# EAGLE design Adafruit Proto Doubler PiCowbell (EAGLE 9.6.2)
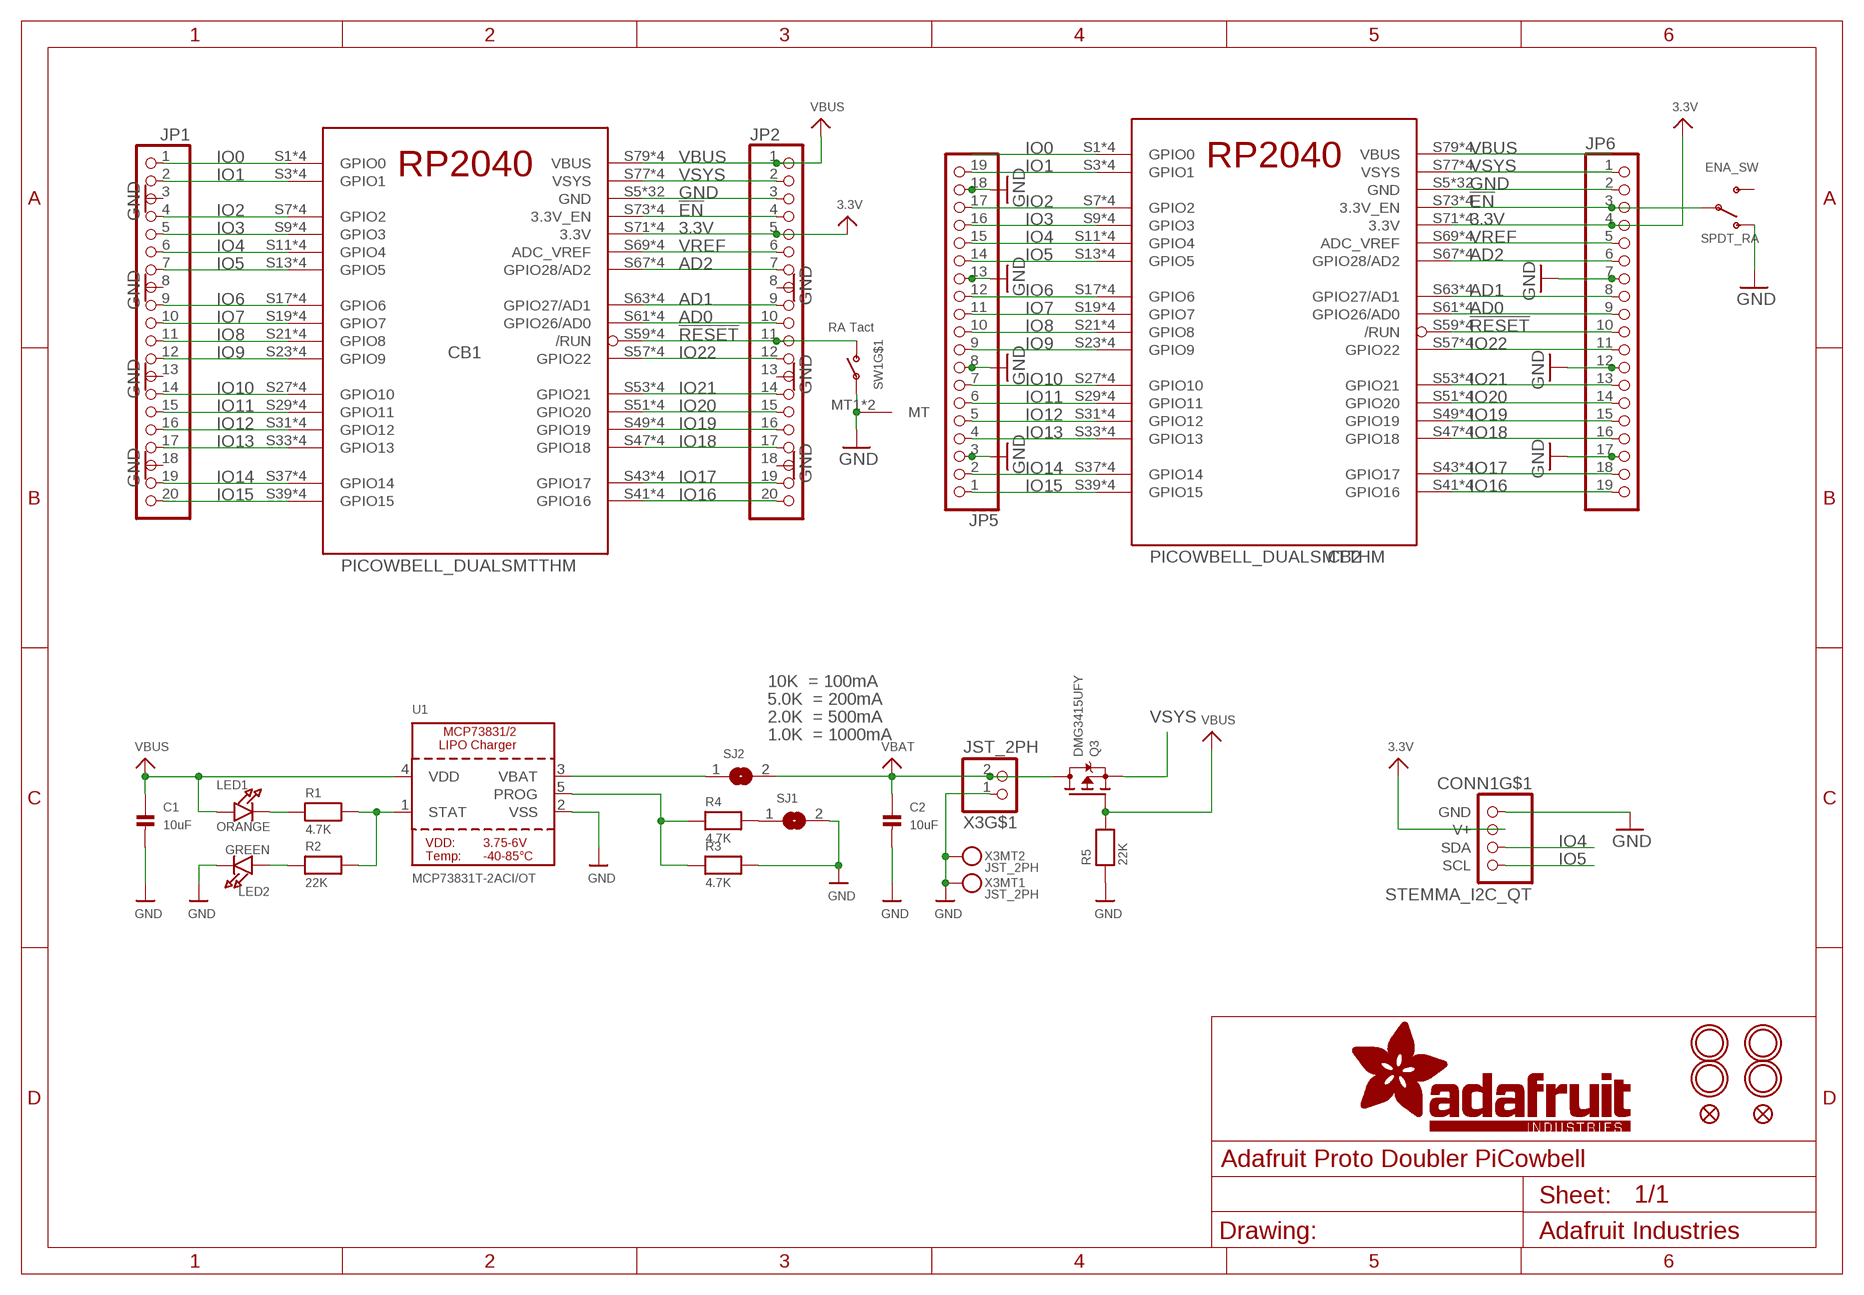
[diagram p0: schematic, sheet 1]

## Parts
C1  10uF  CAP_CERAMIC0805-NOOUTLINE  [0805-NO]
C2  10uF  CAP_CERAMIC0805-NOOUTLINE  [0805-NO]
CB1  PICOWBELL_DUALSMTTHM  [PICOWBELL_DUALSMTTHM]
CB2  PICOWBELL_DUALSMTTHM  [PICOWBELL_DUALSMTTHM]
CONN1  STEMMA_I2C_QT  [JST_SH4]
ENA_SW  SPDT_RA  SWITCH_SPDT  [SPDT_SMT_SSSS811101]
FID1  FIDUCIAL_1MM  [FIDUCIAL_1MM]
FID2  FIDUCIAL_1MM  [FIDUCIAL_1MM]
JP1  HEADER-1X20_70MIL  [1X20_ROUND_70MIL]
JP2  HEADER-1X20_70MIL  [1X20_ROUND_70MIL]
JP5  HEADER-1X19  [1X19_ROUND]
JP6  HEADER-1X19  [1X19_ROUND]
LED1  ORANGE  LED0603_NOOUTLINE  [CHIPLED_0603_NOOUTLINE]
LED2  GREEN  LED0603_NOOUTLINE  [CHIPLED_0603_NOOUTLINE]
Q3  DMG3415UFY  MOSFET-P_DFN2015  [DFN2015-3]
R1  4.7K  RESISTOR_0402NO  [_0402NO]
R2  22K  RESISTOR_0402NO  [_0402NO]
R3  4.7K  RESISTOR_0402NO  [_0402NO]
R4  4.7K  RESISTOR_0402NO  [_0402NO]
R5  22K  RESISTOR_0402NO  [_0402NO]
SJ1  SOLDERJUMPERCLOSED  [SOLDERJUMPER_CLOSEDWIRE]
SJ2  SOLDERJUMPERCLOSED  [SOLDERJUMPER_CLOSEDWIRE]
SW1  RA Tact  SWITCH_SPST_MNT_TACT_RA  [SPST_TACTILE_RA]
U1  MCP73831T-2ACI/OT  MCP73831/2  [SOT23-5]
U$5  MOUNTINGHOLE2.5  [MOUNTINGHOLE_2.5_PLATED]
U$7  MOUNTINGHOLE2.5  [MOUNTINGHOLE_2.5_PLATED]
U$15  MOUNTINGHOLE2.5  [MOUNTINGHOLE_2.5_PLATED]
U$16  MOUNTINGHOLE2.5  [MOUNTINGHOLE_2.5_PLATED]
X3  JST_2PH  CON_JST_PH_2PIN_MT_BATT  [JSTPH2_BATT]

## Nets
3.3V [3V]: CB1.S71(3.3V) CB1.S72(3.3V) CB1.T71(3.3V) CB1.T72(3.3V) CB2.S71(3.3V) CB2.S72(3.3V) CB2.T71(3.3V) CB2.T72(3.3V) CONN1.2(V+) JP2.5 JP6.4
!EN: CB1.S73(3.3V_EN) CB1.S74(3.3V_EN) CB1.T73(3.3V_EN) CB1.T74(3.3V_EN) CB2.S73(3.3V_EN) CB2.S74(3.3V_EN) CB2.T73(3.3V_EN) CB2.T74(3.3V_EN) ENA_SW.B(P) JP2.4 JP6.3
!RESET: CB1.S59(/RUN) CB1.S60(/RUN) CB1.T59(/RUN) CB1.T60(/RUN) CB2.S59(/RUN) CB2.S60(/RUN) CB2.T59(/RUN) CB2.T60(/RUN) JP2.11 JP6.10 SW1.2(S)
AD0: CB1.S61(GPIO26/AD0) CB1.S62(GPIO26/AD0) CB1.T61(GPIO26/AD0) CB1.T62(GPIO26/AD0) CB2.S61(GPIO26/AD0) CB2.S62(GPIO26/AD0) CB2.T61(GPIO26/AD0) CB2.T62(GPIO26/AD0) JP2.10 JP6.9
AD1: CB1.S63(GPIO27/AD1) CB1.S64(GPIO27/AD1) CB1.T63(GPIO27/AD1) CB1.T64(GPIO27/AD1) CB2.S63(GPIO27/AD1) CB2.S64(GPIO27/AD1) CB2.T63(GPIO27/AD1) CB2.T64(GPIO27/AD1) JP2.9 JP6.8
AD2: CB1.S67(GPIO28/AD2) CB1.S68(GPIO28/AD2) CB1.T67(GPIO28/AD2) CB1.T68(GPIO28/AD2) CB2.S67(GPIO28/AD2) CB2.S68(GPIO28/AD2) CB2.T67(GPIO28/AD2) CB2.T68(GPIO28/AD2) JP2.7 JP6.6
GND [GND]: C1.2 C2.2 CB1.S5(GND) CB1.S6(GND) CB1.S15(GND) CB1.S16(GND) CB1.S25(GND) CB1.S26(GND) CB1.S35(GND) CB1.S36(GND) CB1.S45(GND) CB1.S46(GND) CB1.S55(GND) CB1.S56(GND) CB1.S65(GND) CB1.S66(GND) CB1.S75(GND) CB1.S76(GND) CB1.T5(GND) CB1.T6(GND) CB1.T15(GND) CB1.T16(GND) CB1.T25(GND) CB1.T26(GND) CB1.T35(GND) CB1.T36(GND) CB1.T45(GND) CB1.T46(GND) CB1.T55(GND) CB1.T56(GND) CB1.T65(GND) CB1.T66(GND) CB1.T75(GND) CB1.T76(GND) CB2.S5(GND) CB2.S6(GND) CB2.S15(GND) CB2.S16(GND) CB2.S25(GND) CB2.S26(GND) CB2.S35(GND) CB2.S36(GND) CB2.S45(GND) CB2.S46(GND) CB2.S55(GND) CB2.S56(GND) CB2.S65(GND) CB2.S66(GND) CB2.S75(GND) CB2.S76(GND) CB2.T5(GND) CB2.T6(GND) CB2.T15(GND) CB2.T16(GND) CB2.T25(GND) CB2.T26(GND) CB2.T35(GND) CB2.T36(GND) CB2.T45(GND) CB2.T46(GND) CB2.T55(GND) CB2.T56(GND) CB2.T65(GND) CB2.T66(GND) CB2.T75(GND) CB2.T76(GND) CONN1.1(GND) ENA_SW.A(O) JP1.3 JP1.8 JP1.13 JP1.18 JP2.3 JP2.8 JP2.13 JP2.18 JP5.3 JP5.8 JP5.13 JP5.18 JP6.2 JP6.7 JP6.12 JP6.17 LED2.C R3.2 R5.1 SJ1.2 SW1.1(P) SW1.MT1(MT) SW1.MT2(MT) U1.2(VSS) X3.1 X3.NC1 X3.NC2
IO0: CB1.S1(GPIO0) CB1.S2(GPIO0) CB1.T1(GPIO0) CB1.T2(GPIO0) CB2.S1(GPIO0) CB2.S2(GPIO0) CB2.T1(GPIO0) CB2.T2(GPIO0) JP1.1
IO1: CB1.S3(GPIO1) CB1.S4(GPIO1) CB1.T3(GPIO1) CB1.T4(GPIO1) CB2.S3(GPIO1) CB2.S4(GPIO1) CB2.T3(GPIO1) CB2.T4(GPIO1) JP1.2 JP5.19
IO2: CB1.S7(GPIO2) CB1.S8(GPIO2) CB1.T7(GPIO2) CB1.T8(GPIO2) CB2.S7(GPIO2) CB2.S8(GPIO2) CB2.T7(GPIO2) CB2.T8(GPIO2) JP1.4 JP5.17
IO3: CB1.S9(GPIO3) CB1.S10(GPIO3) CB1.T9(GPIO3) CB1.T10(GPIO3) CB2.S9(GPIO3) CB2.S10(GPIO3) CB2.T9(GPIO3) CB2.T10(GPIO3) JP1.5 JP5.16
IO4: CB1.S11(GPIO4) CB1.S12(GPIO4) CB1.T11(GPIO4) CB1.T12(GPIO4) CB2.S11(GPIO4) CB2.S12(GPIO4) CB2.T11(GPIO4) CB2.T12(GPIO4) CONN1.3(SDA) JP1.6 JP5.15
IO5: CB1.S13(GPIO5) CB1.S14(GPIO5) CB1.T13(GPIO5) CB1.T14(GPIO5) CB2.S13(GPIO5) CB2.S14(GPIO5) CB2.T13(GPIO5) CB2.T14(GPIO5) CONN1.4(SCL) JP1.7 JP5.14
IO6: CB1.S17(GPIO6) CB1.S18(GPIO6) CB1.T17(GPIO6) CB1.T18(GPIO6) CB2.S17(GPIO6) CB2.S18(GPIO6) CB2.T17(GPIO6) CB2.T18(GPIO6) JP1.9 JP5.12
IO7: CB1.S19(GPIO7) CB1.S20(GPIO7) CB1.T19(GPIO7) CB1.T20(GPIO7) CB2.S19(GPIO7) CB2.S20(GPIO7) CB2.T19(GPIO7) CB2.T20(GPIO7) JP1.10 JP5.11
IO8: CB1.S21(GPIO8) CB1.S22(GPIO8) CB1.T21(GPIO8) CB1.T22(GPIO8) CB2.S21(GPIO8) CB2.S22(GPIO8) CB2.T21(GPIO8) CB2.T22(GPIO8) JP1.11 JP5.10
IO9: CB1.S23(GPIO9) CB1.S24(GPIO9) CB1.T23(GPIO9) CB1.T24(GPIO9) CB2.S23(GPIO9) CB2.S24(GPIO9) CB2.T23(GPIO9) CB2.T24(GPIO9) JP1.12 JP5.9
IO10: CB1.S27(GPIO10) CB1.S28(GPIO10) CB1.T27(GPIO10) CB1.T28(GPIO10) CB2.S27(GPIO10) CB2.S28(GPIO10) CB2.T27(GPIO10) CB2.T28(GPIO10) JP1.14 JP5.7
IO11: CB1.S29(GPIO11) CB1.S30(GPIO11) CB1.T29(GPIO11) CB1.T30(GPIO11) CB2.S29(GPIO11) CB2.S30(GPIO11) CB2.T29(GPIO11) CB2.T30(GPIO11) JP1.15 JP5.6
IO12: CB1.S31(GPIO12) CB1.S32(GPIO12) CB1.T31(GPIO12) CB1.T32(GPIO12) CB2.S31(GPIO12) CB2.S32(GPIO12) CB2.T31(GPIO12) CB2.T32(GPIO12) JP1.16 JP5.5
IO13: CB1.S33(GPIO13) CB1.S34(GPIO13) CB1.T33(GPIO13) CB1.T34(GPIO13) CB2.S33(GPIO13) CB2.S34(GPIO13) CB2.T33(GPIO13) CB2.T34(GPIO13) JP1.17 JP5.4
IO14: CB1.S37(GPIO14) CB1.S38(GPIO14) CB1.T37(GPIO14) CB1.T38(GPIO14) CB2.S37(GPIO14) CB2.S38(GPIO14) CB2.T37(GPIO14) CB2.T38(GPIO14) JP1.19 JP5.2
IO15: CB1.S39(GPIO15) CB1.S40(GPIO15) CB1.T39(GPIO15) CB1.T40(GPIO15) CB2.S39(GPIO15) CB2.S40(GPIO15) CB2.T39(GPIO15) CB2.T40(GPIO15) JP1.20 JP5.1
IO16: CB1.S41(GPIO16) CB1.S42(GPIO16) CB1.T41(GPIO16) CB1.T42(GPIO16) CB2.S41(GPIO16) CB2.S42(GPIO16) CB2.T41(GPIO16) CB2.T42(GPIO16) JP2.20 JP6.19
IO17: CB1.S43(GPIO17) CB1.S44(GPIO17) CB1.T43(GPIO17) CB1.T44(GPIO17) CB2.S43(GPIO17) CB2.S44(GPIO17) CB2.T43(GPIO17) CB2.T44(GPIO17) JP2.19 JP6.18
IO18: CB1.S47(GPIO18) CB1.S48(GPIO18) CB1.T47(GPIO18) CB1.T48(GPIO18) CB2.S47(GPIO18) CB2.S48(GPIO18) CB2.T47(GPIO18) CB2.T48(GPIO18) JP2.17 JP6.16
IO19: CB1.S49(GPIO19) CB1.S50(GPIO19) CB1.T49(GPIO19) CB1.T50(GPIO19) CB2.S49(GPIO19) CB2.S50(GPIO19) CB2.T49(GPIO19) CB2.T50(GPIO19) JP2.16 JP6.15
IO20: CB1.S51(GPIO20) CB1.S52(GPIO20) CB1.T51(GPIO20) CB1.T52(GPIO20) CB2.S51(GPIO20) CB2.S52(GPIO20) CB2.T51(GPIO20) CB2.T52(GPIO20) JP2.15 JP6.14
IO21: CB1.S53(GPIO21) CB1.S54(GPIO21) CB1.T53(GPIO21) CB1.T54(GPIO21) CB2.S53(GPIO21) CB2.S54(GPIO21) CB2.T53(GPIO21) CB2.T54(GPIO21) JP2.14 JP6.13
IO22: CB1.S57(GPIO22) CB1.S58(GPIO22) CB1.T57(GPIO22) CB1.T58(GPIO22) CB2.S57(GPIO22) CB2.S58(GPIO22) CB2.T57(GPIO22) CB2.T58(GPIO22) JP2.12 JP6.11
N$1: R4.2 SJ1.1
N$2: SJ2.1 U1.3(VBAT)
N$4: LED1.C R1.1
N$5: R1.2 R2.2 U1.1(STAT)
N$7: LED2.A R2.1
N$8: R3.1 R4.1 U1.5(PROG)
VBAT: C2.1 Q3.3(D) SJ2.2 X3.2
VBUS [VBUS]: C1.1 CB1.S79(VBUS) CB1.S80(VBUS) CB1.T79(VBUS) CB1.T80(VBUS) CB2.S79(VBUS) CB2.S80(VBUS) CB2.T79(VBUS) CB2.T80(VBUS) JP2.1 LED1.A Q3.1(G) R5.2 U1.4(VDD)
VREF: CB1.S69(ADC_VREF) CB1.S70(ADC_VREF) CB1.T69(ADC_VREF) CB1.T70(ADC_VREF) CB2.S69(ADC_VREF) CB2.S70(ADC_VREF) CB2.T69(ADC_VREF) CB2.T70(ADC_VREF) JP2.6 JP6.5
VSYS [VSYS]: CB1.S77(VSYS) CB1.S78(VSYS) CB1.T77(VSYS) CB1.T78(VSYS) CB2.S77(VSYS) CB2.S78(VSYS) CB2.T77(VSYS) CB2.T78(VSYS) JP2.2 JP6.1 Q3.2(S)
Unconnected: CONN1.MT1(MT) CONN1.MT2(MT) ENA_SW.C(S)

## Notes on the sheet
- 10K  = 100mA
- 5.0K  = 200mA
- 2.0K  = 500mA
- 1.0K  = 1000mA

## Library data of the parts
C1 C2 = microbuilder:CAP_CERAMIC: Ceramic Capacitors For new designs, use the packages preceded by an '_' character since they are more reliable: The following footprints should be used on most boards: _0402 - Standard footprint for regular board layouts _0603 - Standard footprint for regular board layouts _0805 - Standard footprint for regular board layouts _1206 - Standard footprint for regular board layouts For extremely tight-pitch boards where space is at a premium, the following 'micro-pitch' footprints can be used (smaller pads, no silkscreen outline, etc.): _0402MP - Micro-pitch footprint for very dense/compact boards _0603MP - Micro-pitch footprint for very dense/compact boards _0805MP - Micro-pitch footprint for very dense/compact boards _1206MP - Micro-pitch footprint for very dense/compact boards
CB1 CB2 = adafruit_micro:PICOWBELL
CONN1 = adafruit_electromech:STEMMA_I2C; LCSC: C2845363
ENA_SW = adafruit_electromech:SWITCH_SPDT: Switch - SPDT SSSS811101 - Horizontal Two Position SMT, 0.3A 4V [Mouser: 688-SSSS811101]
FID1 FID2 = microbuilder:FIDUCIAL: Fiducial Alignment Points Various fiducial points for machine vision alignment.; BOM: EXCLUDE
JP1 JP2 = adafruit_electromech:HEADER-1X20
JP5 JP6 = microbuilder:HEADER-1X19
LED1 LED2 = microbuilder:LED: LED 0603 - 0603 Surface Mount Package 2mA: Green LED - Low Power (3.9mcd, 2ma, 1.7Vf) - Digikey: 475-2709-2-ND Orange LED - Low Power (9.8mcd, 2ma, 1.8Vf) - Digikey: 475-1194-2-ND Red LED - Low Power (5mcd, 2ma, 1.8Vf) - Digikey: 475-1195-2-ND Yellow LED - Low Power (7mcd, 2ma, 1.8Vf) - Digikey: 475-1196-2-ND 5mA: Blue LED - Low Power (17mcd, 5ma, 2.9Vf) - Digikey: LNJ937W8CRACT-ND 0805 - 0805 Surface Mount Package 2mA: Red LED (8.8mcd, 2mA, 1.8Vf, Clear) - Low Power [Digikey: 475-2510-1-ND] Green LED (5mcd, 2mA, 1.8Vf, Clear) - Low Power [Digikey: 475-2730-1-ND] Yellow LED (11.3mcd, 2mA, 1.8Vf, Clear) - Low Power [Digikey: 475-2555-1-ND] 20mA: Red LED (104mcd, 20mA, Diffused) - LS R976 [Digikey: 475-1278-6-ND] Red LED (12mcd, 20mA, 2.0Vf, Clear) - APT2012EC [Digikey: 754-1128-1-ND] Green LED (15mcd, 20mA, 2.2Vf, Clear) - APT2012GC [Digikey: 754-1131-1-ND] Orange LED (160mcd, 20mA, 2.1Vf, Clear) - APT2012SECK [Digikey: 754-1130-1-ND] 1206 - 1206 Surface Mount Package Green LED (26mcd, 20mA, Diffused) - LG N971 [Digikey: 475-1407-6-ND] Red LED (15mcd, 20mA, Diffused) - LH N974 [Digikey: 475-1416-6-ND] Cree - Cree High-Power Surface Mount LEDs XPEBWT-L1-0000-00D50 - White 111lm 350mA 2.9Vf 6200K 110° XTEAWT-00-0000-00000LEE3 - White 114lm 350mA 2.85Vf 5000K 115° Everlight - Everlight 45-21 Series Surface Mount LEDs 45-21/QK2C-B2832AC2CB2/2T - Warm White 2000mcd 20mA 3.25Vf 3050K 120° 45-21/LK2C-B38452C4CB2/2T - Nuetral White 2000mcd 20mA 3.25Vf 4150K 120° 45-21/LK2C-B50634C6CB2/2T - Cold White 2200mcd 20mA 3.25Vf 5650K 120° PLCC2 Reverse Mount LS T77K-J1L2-1-0-2-R18-Z - Red 11.25mcd 2mA 1.8Vf 630nm 120° LO T77K-L1M2-24-Z - Orange 19.6mcd 2mA 1.8Vf 606nm 120° LY T77K-K2M1-26-Z - Yellow 15.7mcd 2mA 1.8Vf 587nm 120°; JLC_ROTATION: 270
Q3 = microbuilder:MOSFET-P: P-Channel Mosfet LEGEND VDS: Voltage Drain-Source ID: Drain Current RDS(ON): Drain-Source On-State Resistance VGS(TH): Gate-Source Threshold Voltage CISS: Drain-Source Input Capacitance SOT-23 Name VDS ID RDS(ON) VGS(TH) CISS Order Number IRLML5103 30V 760mA 600 mOhm -- 75pF @ 25V Digikey: IRLML5103PBFCT-ND IRLML6401 12V 4.3A 50 mOhm 950mV @ 250µA 830pF @ 10V Digikey: IRLML6401PBFTR-ND NTR0202PL 20V 400mA 800 mOhm 2.3V @ 250uA 70pF @ 5V Digikey: NTR0202PLT1GOSTR-ND NTR4101PT1G 20V 1.8A 85 mOhm 1.2V @ 250uA 675pF @ 10V Digikey: NTR4101PT1GOSCT-ND DMP2004K 20V 600mA 900 mOhm 1V @ 250uA 175pF @ 16V Digikey: DMP2004KDICT-ND PMV65XP 20V 3.9A 76 mOhm 950mV @ 1mA 725pF @ 20V Digikey: 568-2358-2-ND TO-252 Name VDS ID RDS(ON) VGS(TH) CISS Order Number AOD417 30V 25A 34 mOhm 3V @ 250µA 920pF @ 15V Digikey: 785-1106-2-ND PowerPak Name VDS ID RDS(ON) VGS(TH) CISS Order Number AON7401 30V 12A 14 mOhm 3V @ 250µA 2600pF @ 15V Digikey: 785-1302-1-ND
R1-R5 = microbuilder:RESISTOR: Resistors For new designs, use the packages preceded by an '_' character since they are more reliable: The following footprints should be used on most boards: _0402 - Standard footprint for regular board layouts _0603 - Standard footprint for regular board layouts _0805 - Standard footprint for regular board layouts _1206 - Standard footprint for regular board layouts For extremely tight-pitch boards where space is at a premium, the following 'micro-pitch' footprints can be used (smaller pads, no silkscreen outline, etc.): _0402MP - Micro-pitch footprint for very dense/compact boards _0603MP - Micro-pitch footprint for very dense/compact boards _0805MP - Micro-pitch footprint for very dense/compact boards _1206MP - Micro-pitch footprint for very dense/compact boards
SJ1 SJ2 = microbuilder:SOLDERJUMPER: SMD Solder JUMPER Solder the two pads together to create a connection, or remove the solder to break it. REFLOW - Use this footprint for solder paste and reflow ovens. WAVE - Use this footprint for hand-soldering (larger pads). CLOSED - Has a trace between the two pads to ensure it is closed by default. The trace needs to be cut to disable the jumper, and can be closed again by creating a solder bridge between the two pads.
SW1 = adafruit_electromech:SWITCH_SPST_MNT: Switch - SPST 4UCon 19192 (6.7x2.6mm SMT); LCSC: C778159
U1 = microbuilder:MCP73831/2: MCP73831/2 LIPO Charger VDD: 3.75 - 6V Temp -40 - 85°C Programmable Charge Rate: 15-500mA NOTE: STAT is a tri-state logic output on the MCP73831 and an open-drain output on the MCP73832. SOT23-5 with 4.2V output and tri-state logic on STAT = MCP73831T-2ACI/OT; JLC_ROTATION: 0; LCSC: C424093
U$5 U$7 U$15 U$16 = adafruit_electromech:MOUNTINGHOLE: Mounting Hole For #2 screws (0.086"/2.18mm width, 0.094"/2.4mm hole) use 2.5mm; BOM: EXCLUDE
X3 = adafruit_electromech:CON_JST_PH_2PIN_MT; LCSC: C47647

## Net classes
1 GND: width 0.406 mm
2 VBUS: width 0.406 mm
3 VSYS: width 0.406 mm
4 3V: width 0.406 mm

## Board
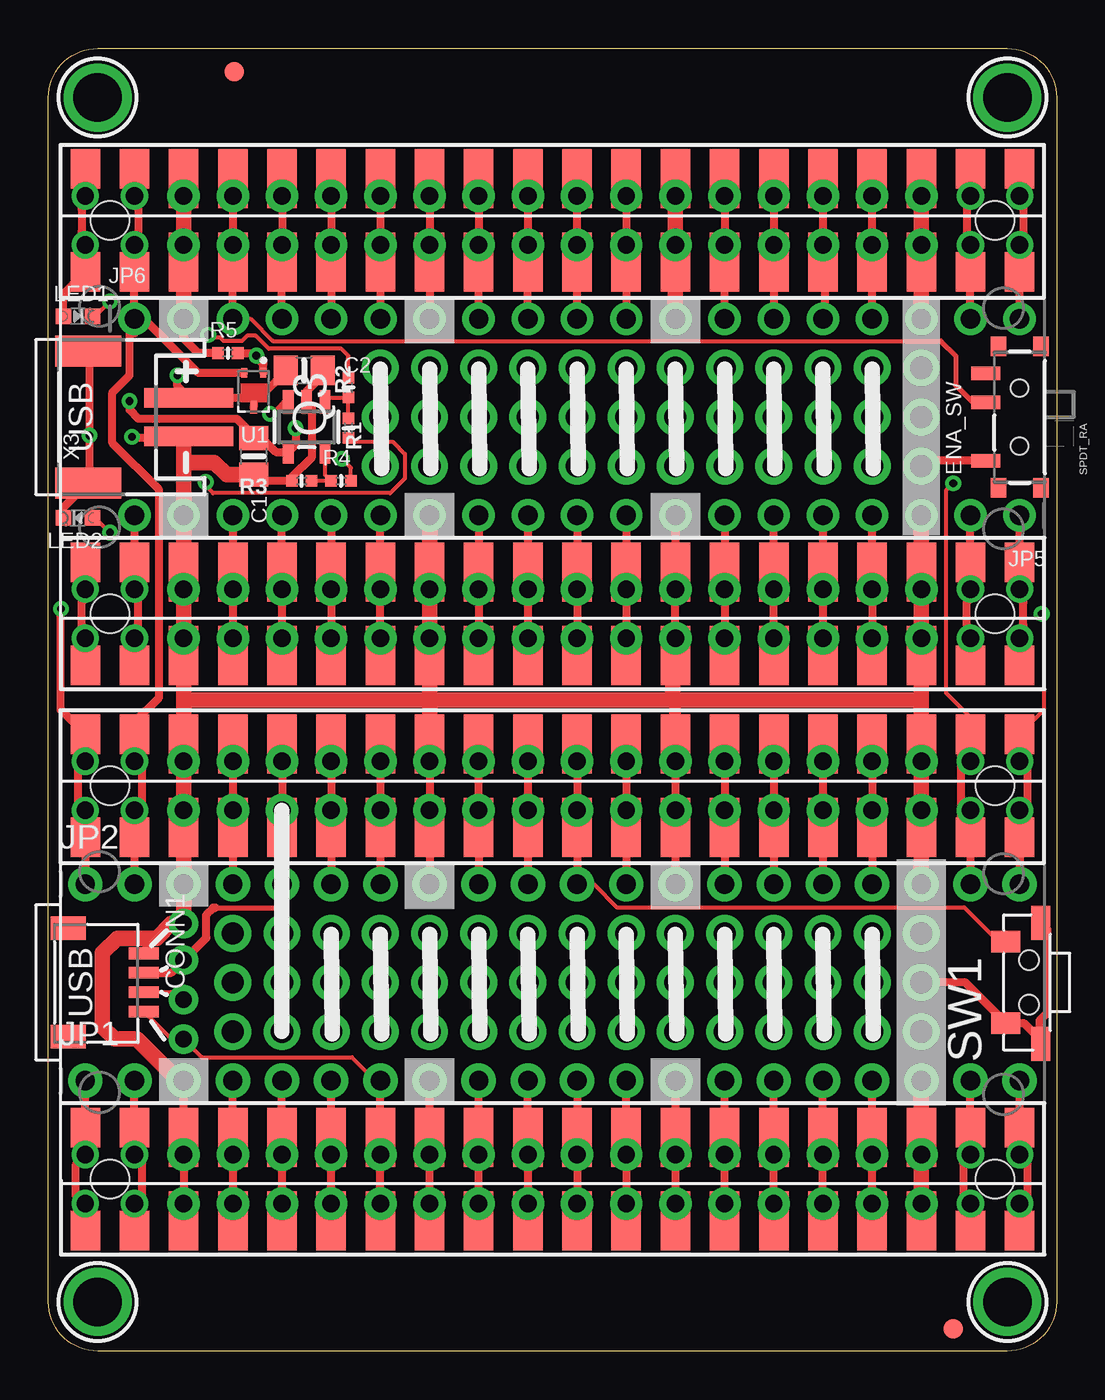
[diagram p1: board, top side]
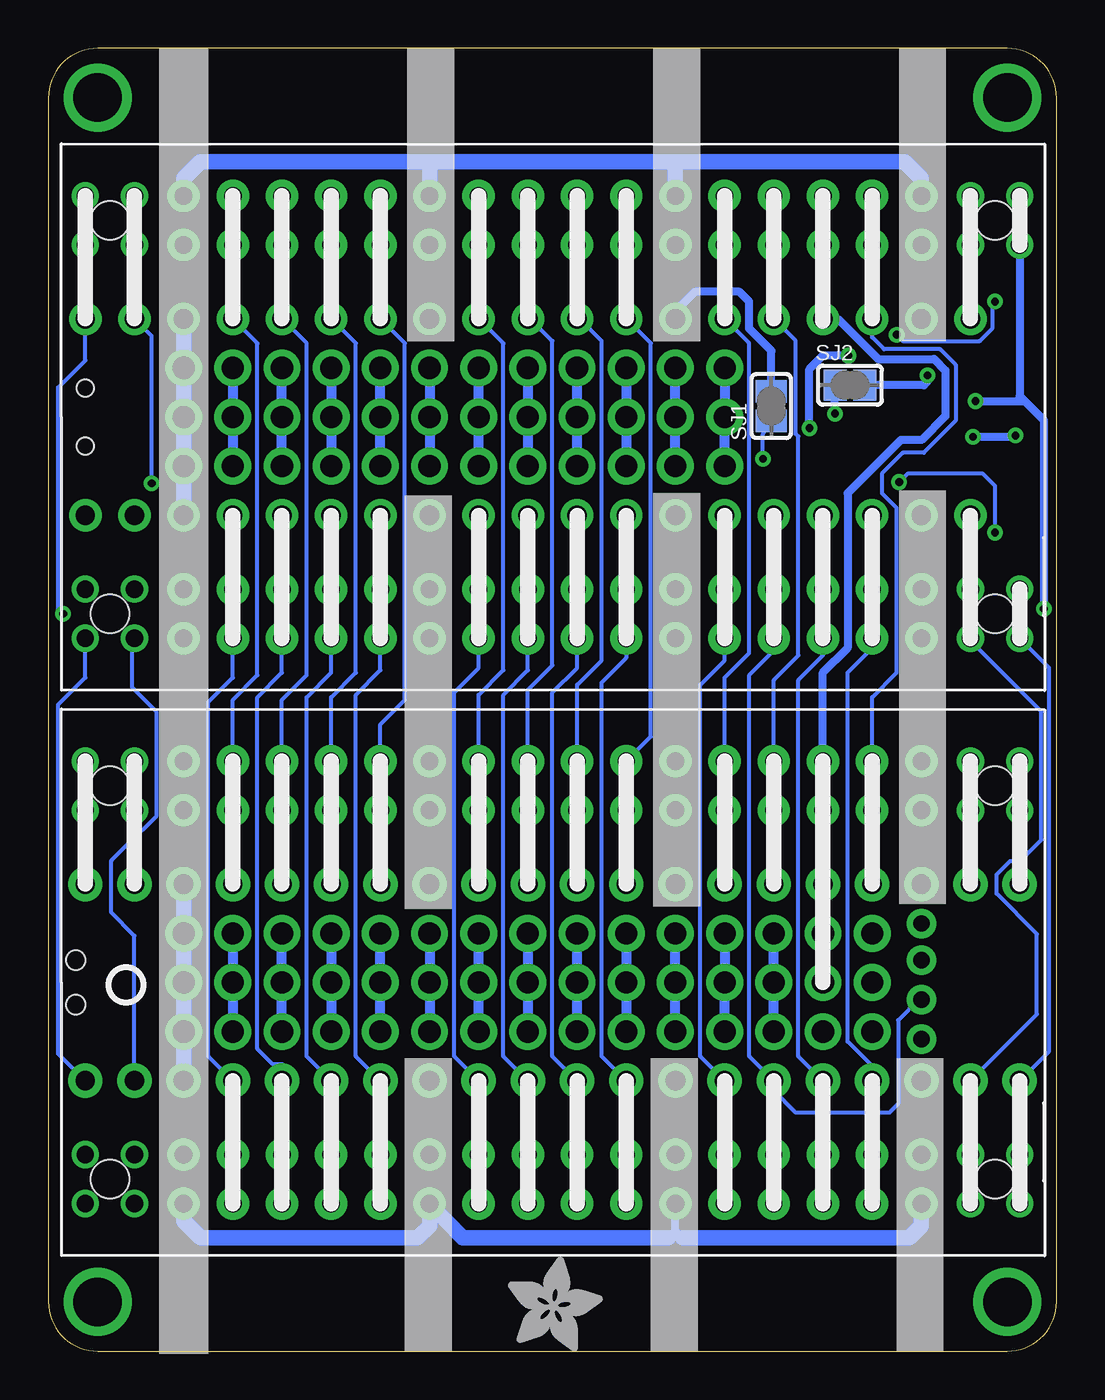
[diagram p2: board, bottom side, seen from below]

Size 52.07 x 67.31 mm. Coordinates in mm from the lower left corner, seen from the top.
Outline: 49.53,0 2.54,0 arc-90 0,2.54 0,64.77 arc-90 2.54,67.31 49.53,67.31 arc-90 52.07,64.77 52.07,2.54 arc-90 49.53,0
Copper layers (1*16): Top 0.035mm / dielectric 1.5mm / Bottom 0.035mm
Design rules "adafruit": minimum track width 8mil, minimum drill 15.5mil, track to track 8mil, track to pad 8mil, pad to pad 8mil, via to via 8mil, smd to smd 8mil, copper to edge 10mil, drill to drill 8mil, minimum pad ring 10mil, minimum via ring 8mil, stop-mask expansion 2mil, vias tented up to drill 20mil, thermal gap 10mil

### Footprints (pad centres in the part's own frame; a part is rotated, then mirrored left to right if it is on the bottom)
0805-NO = smd 1.24 x 1.5: 1 -0.95,0; 2 0.95,0
PICOWBELL_DUALSMTTHM = smd 1.524 x 2.032: S1 -24.13,-12.829; S2 -24.13,-7.495; S3 -21.59,-12.829; S4 -21.59,-7.495; S37 21.59,-12.829; S38 21.59,-7.495; S39 24.13,-12.829; S40 24.13,-7.495; S41 24.13,12.829; S42 24.13,7.495; S43 21.59,12.829; S44 21.59,7.495; S77 -21.59,7.495; S78 -21.59,12.829; S79 -24.13,7.495; S80 -24.13,12.829 | smd 1.524 x 3.048: S5 -19.05,-12.321; S6 -19.05,-8.003; S7 -16.51,-12.321; S8 -16.51,-8.003; S9 -13.97,-12.321; S10 -13.97,-8.003; S11 -11.43,-12.321; S12 -11.43,-8.003; S13 -8.89,-12.321; S14 -8.89,-8.003; S15 -6.35,-12.321; S16 -6.35,-8.003; S17 -3.81,-12.321; S18 -3.81,-8.003; S19 -1.27,-12.321; S20 -1.27,-8.003; S21 1.27,-12.321; S22 1.27,-8.003; S23 3.81,-12.321; S24 3.81,-8.003; S25 6.35,-12.321; S26 6.35,-8.003; S27 8.89,-12.321; S28 8.89,-8.003; S29 11.43,-12.321; S30 11.43,-8.003; S31 13.97,-12.321; S32 13.97,-8.003; S33 16.51,-12.321; S34 16.51,-8.003; S35 19.05,-12.321; S36 19.05,-8.003; S45 19.05,8.003; S46 19.05,12.321; S47 16.51,8.003; S48 16.51,12.321; S49 13.97,8.003; S50 13.97,12.321; S51 11.43,8.003; S52 11.43,12.321; S53 8.89,8.003; S54 8.89,12.321; S55 6.35,8.003; S56 6.35,12.321; S57 3.81,8.003; S58 3.81,12.321; S59 1.27,8.003; S60 1.27,12.321; S61 -1.27,8.003; S62 -1.27,12.321; S63 -3.81,8.003; S64 -3.81,12.321; S65 -6.35,8.003; S66 -6.35,12.321; S67 -8.89,8.003; S68 -8.89,12.321; S69 -11.43,8.003; S70 -11.43,12.321; S71 -13.97,8.003; S72 -13.97,12.321; S73 -16.51,8.003; S74 -16.51,12.321; S75 -19.05,8.003; S76 -19.05,12.321 | drill 0.9 pad 1.27: T1 -24.13,-11.43; T2 -24.13,-8.89; T3 -21.59,-11.43; T4 -21.59,-8.89; T37 21.59,-11.43; T38 21.59,-8.89; T39 24.13,-11.43; T40 24.13,-8.89; T41 24.13,11.43; T42 24.13,8.89; T43 21.59,11.43; T44 21.59,8.89; T77 -21.59,11.43; T78 -21.59,8.89; T79 -24.13,11.43; T80 -24.13,8.89 | drill 0.9 pad 1.676: T5 -19.05,-11.43; T6 -19.05,-8.89; T7 -16.51,-11.43; T8 -16.51,-8.89; T9 -13.97,-11.43; T10 -13.97,-8.89; T11 -11.43,-11.43; T12 -11.43,-8.89; T13 -8.89,-11.43; T14 -8.89,-8.89; T15 -6.35,-11.43; T16 -6.35,-8.89; T17 -3.81,-11.43; T18 -3.81,-8.89; T19 -1.27,-11.43; T20 -1.27,-8.89; T21 1.27,-11.43; T22 1.27,-8.89; T23 3.81,-11.43; T24 3.81,-8.89; T25 6.35,-11.43; T26 6.35,-8.89; T27 8.89,-11.43; T28 8.89,-8.89; T29 11.43,-11.43; T30 11.43,-8.89; T31 13.97,-11.43; T32 13.97,-8.89; T33 16.51,-11.43; T34 16.51,-8.89; T35 19.05,-11.43; T36 19.05,-8.89; T45 19.05,11.43; T46 19.05,8.89; T47 16.51,11.43; T48 16.51,8.89; T49 13.97,11.43; T50 13.97,8.89; T51 11.43,11.43; T52 11.43,8.89; T53 8.89,11.43; T54 8.89,8.89; T55 6.35,11.43; T56 6.35,8.89; T57 3.81,11.43; T58 3.81,8.89; T59 1.27,11.43; T60 1.27,8.89; T61 -1.27,11.43; T62 -1.27,8.89; T63 -3.81,11.43; T64 -3.81,8.89; T65 -6.35,11.43; T66 -6.35,8.89; T67 -8.89,11.43; T68 -8.89,8.89; T69 -11.43,11.43; T70 -11.43,8.89; T71 -13.97,11.43; T72 -13.97,8.89; T73 -16.51,11.43; T74 -16.51,8.89; T75 -19.05,11.43; T76 -19.05,8.89 | hole 2: -22.86,-10.16; 22.86,-10.16; 22.86,10.16; -22.86,10.16
JST_SH4 = smd 0.6 x 1.55: 1 -1.5,2.006; 2 -0.5,2.006; 3 0.5,2.006; 4 1.5,2.006 | smd 1.2 x 1.8: MT1 -2.8,-1.894; MT2 2.8,-1.894
SPDT_SMT_SSSS811101 = smd 0.7 x 1.5: A -2.25,1.242; B 0.75,1.242; C 2.25,1.242 | smd 1 x 0.8: SUP1 -3.65,0.592; SUP2 -3.65,-1.608; SUP3 3.65,0.592; SUP4 3.65,-1.608 | hole 0.9: -1.5,-0.508; 1.5,-0.508
FIDUCIAL_1MM = smd 1 x 1: 1 0,0
1X20_ROUND_70MIL = drill 1 pad 1.778: 1 -24.13,0; 2 -21.59,0; 3 -19.05,0; 4 -16.51,0; 5 -13.97,0; 6 -11.43,0; 7 -8.89,0; 8 -6.35,0; 9 -3.81,0; 10 -1.27,0; 11 1.27,0; 12 3.81,0; 13 6.35,0; 14 8.89,0; 15 11.43,0; 16 13.97,0; 17 16.51,0; 18 19.05,0; 19 21.59,0; 20 24.13,0
1X19_ROUND = drill 1 pad 1.676: 1 -22.86,0; 2 -20.32,0; 3 -17.78,0; 4 -15.24,0; 5 -12.7,0; 6 -10.16,0; 7 -7.62,0; 8 -5.08,0; 9 -2.54,0; 10 0,0; 11 2.54,0; 12 5.08,0; 13 7.62,0; 14 10.16,0; 15 12.7,0; 16 15.24,0; 17 17.78,0; 18 20.32,0; 19 22.86,0
CHIPLED_0603_NOOUTLINE = smd 0.8 x 0.8: A 0,-0.75; C 0,0.75
DFN2015-3 = smd 0.5 x 0.31: 1 -0.95,0.5; 2 -0.95,-0.5 | smd 0.65 x 0.31: 3 0.825,0
_0402NO = smd 0.6 x 0.6: 1 -0.508,0; 2 0.508,0
SOLDERJUMPER_CLOSEDWIRE = smd 1.168 x 1.6: 1 -0.762,0; 2 0.762,0 | smd 0.635 x 0.203: WIRE 0,0
SPST_TACTILE_RA = smd 1.1 x 1.5: 1 2.1,-0.9; 2 -2.1,-0.9 | smd 1.75 x 1: MT1 3.175,0.9; MT2 -3.075,0.9 | hole 1: 1.15,0.3; -1.15,0.3
SOT23-5 = smd 0.55 x 1.2: 1 -0.95,-1.3; 2 0,-1.3; 3 0.95,-1.3; 4 0.95,1.3; 5 -0.95,1.3
MOUNTINGHOLE_2.5_PLATED = drill 2.5 pad 3.2: P$1 0,0
JSTPH2_BATT = smd 1 x 4.6: 1 -1,-2.049; 2 1,-2.049 | smd 1.6 x 3.4: NC1 -3.4,3.151; NC2 3.4,3.151

### Placement (x,y rotation side)
C1  10.6,46.23 270 top
C2  13.21,50.67 0 top
CB1  26.04,19.05 0 top
CB2  26.04,48.26 0 top
CONN1  2.92,19.05 270 top
ENA_SW  49.66,48.26 90 top
FID1  9.59,66.1 0 top
FID2  46.74,1.14 0 top
JP1  26.04,13.97 0 top
JP2  26.04,24.13 0 top
JP5  27.3,43.18 180 top
JP6  27.3,53.34 0 top
LED1  1.52,53.47 270 top
LED2  1.52,43.05 90 top
PLABEL0  [PLABEL0]  47.82,18.92 90 top
PLABEL1  [PLABEL1]  6.86,4.7 90 top
PLABEL2  [PLABEL2]  9.4,4.7 90 top
PLABEL3  [PLABEL3]  11.94,4.7 90 top
PLABEL4  [PLABEL4]  14.48,4.7 90 top
PLABEL5  [PLABEL5]  17.02,4.7 90 top
PLABEL6  [PLABEL6]  19.56,4.7 90 top
PLABEL7  [PLABEL7]  32.26,4.7 90 top
PLABEL8  [PLABEL8]  44.96,4.7 90 top
PLABEL9  [PLABEL9]  22.1,4.7 90 top
PLABEL10  [PLABEL10]  24.64,4.7 90 top
PLABEL11  [PLABEL11]  27.18,4.7 90 top
PLABEL12  [PLABEL12]  29.72,4.7 90 top
PLABEL13  [PLABEL13]  34.8,4.7 90 top
PLABEL14  [PLABEL14]  39.88,4.7 90 top
PLABEL15  [PLABEL15]  37.34,4.7 90 top
PLABEL16  [PLABEL16]  42.42,4.7 90 top
PLABEL36  [PLABEL36]  38.86,2.79 0 bottom
PLABEL37  [PLABEL37]  13.34,2.79 0 bottom
PLABEL38  [PLABEL38]  5.97,22.1 0 bottom
PLABEL39  [PLABEL39]  5.97,20.19 0 bottom
PLABEL40  [PLABEL40]  5.97,18.16 0 bottom
PLABEL41  [PLABEL41]  5.97,16.13 0 bottom
PLABEL42  [PLABEL42]  46.8,48.26 90 top
PLABEL43  [PLABEL43]  47.37,51.82 0 top
PLABEL44  [PLABEL44]  47.24,44.77 0 top
PLABEL45  [PLABEL45]  8.89,49.72 0 bottom
PLABEL46  [PLABEL46]  15.88,46.16 0 bottom
PLABEL47  [PLABEL47]  1.78,21.72 270 bottom
PLABEL48  [PLABEL48]  1.78,50.74 270 bottom
PLABEL59  [PLABEL17]  45.09,62.61 90 top
PLABEL60  [PLABEL18]  32.38,62.61 90 top
PLABEL61  [PLABEL19]  19.69,62.61 90 top
PLABEL62  [PLABEL20]  6.98,62.61 90 top
PLABEL63  [PLABEL21]  9.52,62.61 90 top
PLABEL64  [PLABEL22]  12.06,62.61 90 top
PLABEL65  [PLABEL23]  14.61,62.61 90 top
PLABEL66  [PLABEL24]  17.14,62.61 90 top
PLABEL67  [PLABEL25]  22.23,62.61 90 top
PLABEL68  [PLABEL26]  24.77,62.61 90 top
PLABEL69  [PLABEL27]  27.3,62.61 90 top
PLABEL70  [PLABEL28]  29.84,62.61 90 top
PLABEL71  [PLABEL29]  34.92,62.61 90 top
PLABEL72  [PLABEL30]  37.47,62.61 90 top
PLABEL73  [PLABEL31]  40.01,62.61 90 top
PLABEL74  [PLABEL32]  42.55,62.61 90 top
PLABEL75  [PLABEL33]  38.73,64.77 0 bottom
PLABEL76  [PLABEL34]  26.04,64.77 0 bottom
PLABEL77  [PLABEL35]  13.08,64.52 0 bottom
Q3  10.6,49.59 270 top
R1  15.49,49.78 270 top
R2  15.49,47.69 90 top
R3  13.08,44.96 180 top
R4  15.11,44.96 0 top
R5  9.27,51.56 0 top
SJ1  14.73,48.83 90 bottom
SJ2  10.67,49.91 0 bottom
SW1  50.36,19.05 270 top
U1  13.34,47.75 180 top
U$5  2.54,2.54 0 top
U$6  [PCBFEAT-REV-040]  48.07,18.92 180 bottom
U$7  49.53,2.54 0 top
U$10  [ADAFRUIT_5MM]  28.32,0 0 bottom
U$15  2.54,64.77 0 top
U$16  49.53,64.77 0 top
X3  5.21,48.26 90 top

### Tracks (layer width: path | path; a pad name or v marks a point on that pad's centre or on a via)
3.3V  (via drill 0.85 pad 1.52, 1.14 pad 1.91)
  Top 0.254: 8.64,22.91 12.01,22.91
  Top 0.406: CONN1.2 6.34,19.55 v6.98,20.19 8.15,21.36 8.15,22.55 8.51,22.91 8.64,22.91 | CB1.S71 JP2.5 | JP2.5 | CB1.T71 12.06,30.54 CB1.S72 12.06,28 CB1.T72 | 12.01,22.91 12.06,22.86 | JP6.4 CB2.S71 | CB2.T71 CB2.S72 CB2.T72 | CB2.T71 | CB2.T72
  Top 0.813: v12.06,16.51 v12.06,19.05 v12.06,21.59 12.06,22.86 JP2.5 | JP2.5
  Bottom 0.406: CB1.T71 12.06,35.05 10.79,36.32 10.79,44.33 8.04,47.08 6.96,47.08 5.74,48.3 5.74,50.67 6.33,51.26 9.22,51.26 11.3,53.34 JP6.4
!EN
  Top 0.203: 10.29,53.34 10.45,53.34 11.59,52.2 46.1,52.2
  Top 0.254: JP6.3 10.29,53.34 | ENA_SW.B 47.76,49.01 46.86,49.91 46.86,51.44 46.1,52.2
  Top 0.406: JP2.4 CB1.S73 9.52,27.11 CB1.T74 9.52,28 CB1.S74 9.52,30.54 CB1.T73 | JP2.4 | CB2.T73 CB2.S74 CB2.T74 | CB2.T73 | JP6.3 9.52,55.63 9.65,55.75 9.65,56.14 CB2.S73 CB2.T74 | CB2.T74
  Bottom 0.203: CB1.T73 9.52,33.78 8.25,35.05 8.25,43.56 9.02,44.32 9.02,45.34 7.94,46.42 6.86,46.42 5.21,48.07 5.21,50.97 6.01,51.77 8.9,51.77 9.52,52.39 JP6.3
!RESET
  Top 0.203: JP2.11 28.16,24.13 29.35,22.94 47.3,22.94 49.08,21.15 SW1.2
  Top 0.406: JP2.11 CB1.S59 27.3,28 | JP2.11 | CB1.T59 27.3,31.43 CB1.S60 27.3,28 | 27.3,28 CB1.T60 | CB2.S60 CB2.T59 | CB2.T59 | CB2.S59 CB2.T60 | CB2.T60 | CB2.S59 CB2.T59 | JP6.10 | JP6.10 CB2.S59
  Bottom 0.203: CB1.T59 27.3,34.16 26.04,35.43 26.04,52.2 27.3,53.47
  Bottom 0.254: JP6.10 27.3,53.47
AD0
  Top 0.406: CB1.S61 JP2.10 | JP2.10 | CB1.T61 24.77,31.43 CB1.S62 24.77,28 CB1.T62 | CB2.T61 CB2.S62 CB2.T62 | CB2.T61 | CB2.T62 | CB2.T62 CB2.S61 JP6.9
  Top 0.508: CB1.S61 24.77,27.11 CB1.T62
  Bottom 0.203: CB1.T61 24.77,34.42 23.5,35.69 23.5,52.2 24.64,53.34 JP6.9
AD1
  Top 0.406: CB1.S63 JP2.9 | JP2.9 | CB1.S64 22.23,31.43 CB1.T63 22.23,30.54 CB1.S63 | CB1.S63 22.23,27.11 CB1.T64 | CB2.T63 | CB2.T63 CB2.S64 CB2.T64 | CB2.T64 | CB2.T64 CB2.S63 JP6.8
  Bottom 0.203: CB1.T63 20.95,31.75 20.95,52.07 JP6.8
AD2
  Top 0.406: CB1.S67 JP2.7 | JP2.7 | CB1.T67 17.14,30.54 CB1.S68 17.14,28 CB1.T68 | JP6.6 | CB2.S67 JP6.6 | CB2.T67 CB2.S68 CB2.T68 | CB2.T67 | CB2.T68
  Bottom 0.203: CB1.T67 17.14,34.8 15.88,36.07 15.88,52.07 JP6.6
GND  (via drill 0.4, 0.85 pad 1.52, 1.14 pad 1.91)
  Top 0.406: CONN1.1 4.93,20.68 5.59,21.34 | 51.19,16.13 51.19,17.08 51.61,17.5 51.61,21.77 SW1.MT2 | SW1.MT1 51.26,16.07 51.19,16.13 | 51.19,16.13 50.37,16.95 SW1.1 47.36,19.05 v45.09,19.05 | CB1.S6 6.98,10.99 CB1.T6 | CB1.S6 6.98,7.56 | 6.98,7.56 CB1.T5 | CB1.S5 6.98,7.56 | CB1.T16 19.69,10.99 CB1.S16 JP1.8 | CB1.T15 19.69,6.67 CB1.S15 CB1.T16 | CB1.T16 | 32.38,7.56 CB1.T25 | CB1.S25 32.38,7.56 | CB1.T36 45.09,10.99 CB1.S36 | CB1.S35 45.09,6.67 CB1.T35 | JP1.8 | CB1.S6 6.98,13.89 | CB1.S55 JP2.13 | JP2.13 | CB1.S65 JP2.8 | JP2.8 | CB1.S76 6.98,30.54 CB1.T75 | 6.98,28 CB1.T76 | CB1.T66 19.69,28 19.69,30.54 | CB1.S46 45.09,30.54 CB1.T45 | 45.09,28 CB1.T46 | CB1.T55 32.38,30.54 CB1.S56 32.38,28 CB1.T56 | 19.69,30.54 19.69,30.61 CB1.S66 | 19.69,30.54 CB1.T65 | CB1.S26 32.38,10.99 CB1.T26 | CB1.S26 32.38,7.56 | CB1.S26 32.38,10.99 JP1.13 | CB2.S5 CB2.T5 | CB2.T5 | CB2.S16 | 19.69,35.31 CB2.S15 CB2.T15 | 19.69,35.31 | CB2.T15 | CB2.S16 CB2.T16 | CB2.S16 | CB2.T25 CB2.S25 CB2.T26 | CB2.T25 | CB2.S35 CB2.T35 | 6.98,55.63 7.11,55.75 7.18,55.69 7.18,56.07 CB2.S75 | CB2.S76 CB2.T75 | CB2.T75 | CB2.T65 CB2.S66 CB2.T66 | CB2.T65 | JP6.7 CB2.S65 CB2.T66 | JP6.7 | CB2.T66 | CB2.S45 CB2.T46 | CB2.T46 | CB2.T45 | CB2.S46 CB2.T45 | CB2.S26 32.38,40.89 | 32.38,40.89 | 32.38,40.89 CB2.T26 | CB2.T26 | JP5.8 32.38,40.89 | CB2.S75 | CB2.S75 CB2.T76 | CB2.T76 | C2.2 14.16,50.42 13.34,49.6 U1.2 13.59,48.8 13.59,46.16 12.57,45.15 R3.2 11.3,44.96 10.98,45.28 C1.2 | LED2.C 0.77,43.58 X3.NC1 2.12,44.92 v2.12,47.31 2.12,51.6 X3.NC2 | v4.32,47.24 4.38,47.18 6.03,47.18 6.22,46.99 6.98,46.99 | R5.1 7.75,51.56 6.98,52.32 JP6.2 | ENA_SW.A 45.38,46.01 v45.09,45.72 | JP1.18 | JP2.18 | JP2.3 | CB2.T6 | CB2.T56 | JP6.17
  Top 0.508: CB1.S45 45.09,27.11 CB1.T46 | CB1.S65 19.69,27.11 CB1.T66 | CB1.S75 6.98,27.11 CB1.T76 | CB1.S55 32.38,27.11 CB1.T56 | JP1.3 6.98,13.89 | 6.98,13.89
  Top 0.61: CB1.S56 32.38,33.53
  Top 0.813: CB1.T36 CB1.T35 | CB1.S36 JP1.18 | CB1.S45 JP2.18 | CB1.S75 JP2.3 v6.98,22.1 6.35,22.1 5.59,21.34 3.56,21.34 2.79,20.57 2.79,16.76 3.43,16.13 4.57,16.13 6.73,13.97 JP1.3 | CB1.S76 6.98,28 | 45.09,28 CB1.S46 45.09,33.66 | 19.69,30.61 19.69,33.66 | CB1.S76 | CB1.S76 6.98,33.66 | 6.98,33.66 19.69,33.66 | 19.69,33.66 32.26,33.66 | 32.26,33.66 32.38,33.53 | 45.09,33.66 32.26,33.66 | JP5.13 CB2.S16 | 19.69,33.66 19.69,35.31 | CB2.T16 CB2.T15 | 32.26,33.66 32.26,35.81 CB2.S25 | 45.09,33.66 CB2.S35 | CB2.S35 | JP6.2 6.98,55.63 | JP6.17 CB2.S45 CB2.T45 | CB2.S76 CB2.T76 | JP5.3 45.09,41.15 44.83,40.89 44.83,40.51 CB2.S36 | CB2.S36 CB2.T36 | CB2.T36 | CB2.S36 CB2.T35 | CB2.T35 | JP6.12 CB2.S55 CB2.T56 CB2.S56 CB2.T55 | CB2.T55 | 6.98,45.85 JP5.18 CB2.S6 CB2.T6 CB2.S5 6.98,33.66 | 6.98,45.85 6.98,46.99 X3.1 | C1.2 9.21,45.28 8.57,45.91 7.05,45.91 6.98,45.85
  Bottom 0.406: CB1.S35 CB1.T35 | 20.07,5.84 19.69,6.22 | 19.69,6.22 CB1.T15 | 19.69,6.22 19.3,5.84 | CB2.T75 CB2.S76 | CB2.S46 CB2.T45 | v2.12,47.31 2.18,47.24 v4.32,47.24 | SJ1.2 14.73,51.69 15.88,52.83 15.88,54.23 16.38,54.74 18.67,54.74 19.69,53.72 JP6.7
  Bottom 0.813: CB1.S35 44.2,5.84 33.02,5.84 32.38,6.48 CB1.T25 30.67,5.84 20.07,5.84 | 19.3,5.84 7.62,5.84 6.98,6.48 CB1.T5 | JP1.18 v45.09,16.51 v45.09,19.05 v45.09,21.59 JP2.18 | CB2.S76 7.87,61.47 19.56,61.47 | 32.26,61.47 44.2,61.47 CB2.S46 | JP5.3 v45.09,45.72 v45.09,48.26 v45.09,50.8 JP6.17 | 19.56,61.47 19.69,61.34 CB2.T65 | 19.56,61.47 32.26,61.47 | 32.26,61.47 32.38,61.34 CB2.T55
IO0
  Top 0.406: CB1.S1 1.91,7.56 CB1.T1 1.4,8.07 1.4,9.59 CB1.T2 1.91,10.99 CB1.S2 JP1.1 | JP1.1 | CB2.T1 1.91,37.31 1.72,37.5 1.72,38.7 1.91,38.89 CB2.T2 CB2.S2 | CB2.S1 CB2.T1 | CB2.T1 | CB2.S2
  Bottom 0.203: JP1.1 0.38,15.49 0.38,35.31 CB2.T1
IO1
  Top 0.406: CB1.S4 4.45,10.99 CB1.T4 | CB1.S3 4.45,7.56 CB1.T3 4.83,7.94 4.83,11.11 CB1.S4 | CB1.S4 JP1.2 | JP1.2 | JP5.19 CB2.S4 | CB2.T3 4.45,37.31 4.63,37.5 4.63,38.7 4.45,38.89 CB2.T4 CB2.S4 | CB2.S3 CB2.T3 | CB2.T3 | CB2.S4
  Bottom 0.203: JP1.2 1.02,17.4 1.02,21.55 3.1,23.64 3.1,24.62 2.4,25.32 1.88,25.32 0.79,26.42 0.79,33.05 4.45,36.7 CB2.T3
IO2
  Top 0.406: CB1.S7 9.52,7.56 | 9.52,7.56 CB1.T7 9.52,7.56 | CB1.S8 9.52,10.99 CB1.T8 | CB1.S8 9.52,7.56 | CB1.S8 JP1.4 | JP1.4 | JP5.17 CB2.S8 | CB2.S8 | CB2.S8 CB2.T8 | CB2.S8 CB2.T7 | CB2.T7 | CB2.S7 | CB2.S7 9.52,35.43 | 9.52,35.43 | 9.52,35.43 CB2.T7
  Bottom 0.203: JP1.4 9.52,14.73 10.79,16 10.79,35.05 9.52,36.32 CB2.T7
IO3
  Top 0.406: CB1.S9 12.06,7.56 CB1.T9 CB1.T10 12.06,10.99 CB1.S10 JP1.5 | JP1.5 | JP5.16 | CB2.S9 CB2.T9 | CB2.T9 | CB2.S10 | CB2.S10 CB2.T10 | CB2.S10 CB2.T9 | CB2.S10 JP5.16
  Bottom 0.203: JP1.5 13.34,15.24 13.34,34.67 CB2.S9 CB2.T9
IO4  (via drill 0.85 pad 1.52)
  Top 0.203: CONN1.3 6.47,18.55 6.86,18.16 v6.98,18.16
  Top 0.406: CB1.T11 14.61,7.56 CB1.S11 14.61,10.1 CB1.T12 14.61,10.99 CB1.S12 JP1.6 | JP1.6 | CB2.S12 JP5.15 | CB2.S12 | CB2.S12 CB2.T12 | CB2.S12 CB2.T11 | CB2.T11 | CB2.S11 CB2.T11 | CB2.T11
  Bottom 0.203: v6.98,18.16 7.11,18.16 8.18,17.09 8.18,12.78 8.64,12.32 13.46,12.32 14.61,13.46 JP1.6 15.86,15.23 15.86,34.94 14.61,36.2 CB2.T11
IO5  (via drill 0.85 pad 1.52)
  Top 0.203: CONN1.4 6.35,16.13 v6.98,16.13 7.93,15.19 15.67,15.19 16.89,13.97 JP1.7
  Top 0.406: CB1.S13 17.14,6.67 CB1.T13 CB1.T14 17.14,10.99 CB1.S14 JP1.7 | JP1.7 | JP5.14 | CB2.T13 CB2.S13 CB2.T14 | CB2.T13 | CB2.T14 | CB2.T14 CB2.S14 JP5.14
  Bottom 0.203: JP1.7 18.41,15.24 18.41,34.42 17.14,35.69 CB2.T13
IO6
  Top 0.406: CB1.S17 22.23,6.67 CB1.T17 CB1.T18 22.23,10.99 CB1.S18 JP1.9 | JP1.9 | CB2.S17 CB2.T17 | CB2.T17 | JP5.12 CB2.S18 | CB2.S18 | CB2.S18 CB2.T18 | CB2.S18 CB2.T17
  Bottom 0.203: JP1.9 23.5,15.24 23.5,34.54 22.23,35.81 CB2.T17
IO7
  Top 0.406: CB1.S19 24.77,6.67 CB1.T19 CB1.T20 24.77,10.99 | CB1.S20 24.77,10.99 | 24.77,10.99 JP1.10 | CB2.S19 CB2.T19 | CB2.T19 | JP5.11 CB2.S20 | CB2.S20 | CB2.S20 CB2.T20 | CB2.S20 CB2.T19
  Bottom 0.203: JP1.10 26.04,15.24 26.04,34.04 24.77,35.31 CB2.T19
IO8
  Top 0.406: 27.3,10.99 CB1.T22 | CB1.S21 27.3,6.67 CB1.T21 27.3,7.56 CB1.S22 27.3,10.99 | JP1.11 27.3,10.99 | CB2.S22 | CB2.S22 CB2.T22 | CB2.S22 CB2.T21 | CB2.T21 | CB2.S21 CB2.T21 | JP5.10 27.3,41.02 27.43,40.89 27.43,40.39 CB2.S22
  Bottom 0.203: JP1.11 28.57,15.24 28.57,33.91 27.3,35.18 CB2.T21
IO9
  Top 0.406: CB1.S23 29.84,6.67 CB1.T23 29.84,7.56 CB1.S24 | CB1.S24 29.84,10.99 CB1.T24 | CB1.S24 JP1.12 | JP1.12 | CB2.S23 CB2.T23 | CB2.T23 | CB2.T23 | CB2.S24 JP5.9 | CB2.S24 | CB2.S24 CB2.T24 | CB2.S24 CB2.T23
  Bottom 0.203: JP1.12 31.12,15.24 31.12,34.04 29.84,35.31 CB2.T23
IO10
  Top 0.406: CB1.T27 34.92,6.67 CB1.S27 34.92,10.1 CB1.T28 34.92,10.99 CB1.S28 JP1.14 | JP1.14 | CB2.S27 CB2.T27 | CB2.T27 | JP5.7 CB2.S28 | CB2.S28 | CB2.S28 CB2.T28 | CB2.S28 CB2.T27
  Bottom 0.203: JP1.14 36.2,15.24 36.2,33.91 34.92,35.18 CB2.T27
IO11
  Top 0.406: CB1.T29 37.47,6.67 CB1.S29 37.47,10.1 CB1.T30 37.47,10.99 CB1.S30 JP1.15 | JP1.15 | JP5.6 | CB2.T29 CB2.S29 CB2.T30 | CB2.T29 | CB2.T30 | CB2.T30 CB2.S30 37.47,40.89 | 37.47,40.89 | 37.47,40.89 JP5.6
  Bottom 0.203: JP1.15 38.73,15.24 38.73,33.78 37.47,35.05 CB2.T29
IO12
  Top 0.406: CB1.S31 40.01,6.67 CB1.T31 CB1.T32 40.01,10.99 CB1.S32 JP1.16 | JP1.16 | CB2.S31 CB2.T31 | CB2.T31 | JP5.5 CB2.S32 | CB2.S32 | CB2.S32 CB2.T32 | CB2.S32 CB2.T31 | CB2.T31
  Bottom 0.203: JP1.16 40.01,14.82 40.48,14.82 41.27,15.62 41.27,33.78 40.01,35.05 CB2.T31
IO13
  Top 0.406: CB1.T33 42.55,6.67 CB1.S33 42.55,10.1 CB1.T34 42.55,10.99 CB1.S34 JP1.17 | JP1.17 | CB2.S34 JP5.4 | JP5.4 | CB2.S33 CB2.T33 | CB2.T33 | CB2.S34 | CB2.S34 CB2.T34 | CB2.S34 CB2.T33
  Bottom 0.203: JP1.17 43.81,15.24 43.81,33.53 42.55,34.8 CB2.T33
IO14
  Top 0.406: CB1.S37 47.62,6.67 CB1.T37 47.24,7.94 47.24,9.72 CB1.T38 47.62,10.99 CB1.S38 JP1.19 | JP1.19 | CB2.S38 JP5.2 | JP5.2 | CB2.S38 CB2.T38 47.62,38.89 47.44,38.7 47.44,37.5 47.62,37.31 CB2.T37 | CB2.S38 | CB2.S37 CB2.T37 | CB2.T37
  Bottom 0.203: JP1.19 47.62,21.46 48.82,22.66 48.82,25.35 47.24,26.93 47.21,26.93 46.48,27.66 46.48,33.02 47.75,34.29 47.75,36.7 CB2.T37
IO15
  Top 0.406: CB1.T39 50.16,7.56 CB1.S39 50.55,6.54 50.55,9.72 CB1.T40 50.16,10.1 CB1.S40 JP1.20 | JP1.20 | JP5.1 | CB2.S40 JP5.1 | CB2.T39 50.16,37.31 50.35,37.5 50.35,38.7 50.16,38.89 CB2.T40
  Bottom 0.203: JP1.20 51.56,15.37 51.56,33.4 50.16,34.8 CB2.T39
IO16  (via drill 0.4)
  Top 0.203: CB1.S41 51.44,33.15 51.44,37.97 v51.31,38.1
  Top 0.406: JP2.20 CB1.S42 50.16,28 | JP2.20 | CB1.T41 50.16,30.54 CB1.S41 50.55,31.56 50.55,28 50.16,28 | 50.16,28 CB1.T42 | CB2.T41 50.16,59.21 50.35,59.02 50.35,57.82 50.16,57.63 CB2.T42 CB2.S42 | JP6.19 CB2.S42 | CB2.S42 | CB2.S41 CB2.T41 | CB2.T41
  Bottom 0.203: v51.31,38.1 51.56,38.35 51.56,49.78 50.16,51.18 JP6.19
IO17  (via drill 0.4)
  Top 0.203: CB1.S43 47.62,32.77 46.36,34.04 46.36,44.45 v46.74,44.83
  Top 0.406: JP2.19 CB1.S44 47.12,27.11 47.12,31.43 CB1.S43 47.62,31.43 CB1.T43 | JP2.19 | 47.62,28 CB1.T44 | CB2.S43 CB2.T43 | CB2.T43 | CB2.S44 | CB2.S44 CB2.T44 47.62,57.63 47.44,57.82 47.44,59.02 47.62,59.21 CB2.T43 | JP6.18 CB2.S44
  Top 0.508: CB1.S44 47.62,28
  Bottom 0.203: JP6.18 46.74,52.45 v46.74,44.83
IO18
  Top 0.406: CB1.S47 JP2.17 | JP2.17 | CB1.T47 42.55,30.54 CB1.S48 42.55,28 CB1.T48 | CB2.S48 CB2.T47 | CB2.T47 | CB2.S47 | CB2.S47 CB2.T48 | CB2.S47 CB2.T47 | JP6.16 CB2.S47
  Top 0.508: CB1.S47 42.55,28
  Bottom 0.203: CB1.T47 42.55,33.66 41.27,34.92 41.27,52.07 JP6.16
IO19
  Top 0.406: CB1.S49 JP2.16 | JP2.16 | CB1.T49 40.01,31.43 CB1.S50 40.01,28 CB1.T50 | JP6.15 40.13,53.47 40.13,55.63 40.26,55.75 40.01,56.01 CB2.S49 CB2.T50 | CB2.T49 CB2.S50 CB2.T50 | CB2.T49 | CB2.T50
  Top 0.508: CB1.S49 40.01,27.11 CB1.T50
  Bottom 0.203: CB1.T49 40.01,33.66 38.73,34.92 38.73,52.07 JP6.15
IO20
  Top 0.406: CB1.S51 JP2.15 | JP2.15 | CB1.T51 37.47,30.54 CB1.S52 37.47,28 CB1.T52 | JP6.14 | CB2.S51 JP6.14 | CB2.S52 CB2.T52 | CB2.T52
  Bottom 0.203: CB1.T51 37.47,33.78 36.2,35.05 36.2,52.07 JP6.14
IO21
  Top 0.406: CB1.S53 JP2.14 | JP2.14 | CB1.T53 34.92,30.54 CB1.S54 34.92,28 CB1.T54 | CB2.T53 CB2.S54 CB2.T54 | CB2.T53 | CB2.T54 CB2.S53 JP6.13 | CB2.T54 | CB2.T54
  Top 0.508: CB1.S53 34.92,27.11 CB1.T54
  Bottom 0.203: CB1.T53 34.92,32.39 33.66,33.66 33.66,52.07 JP6.13
IO22
  Top 0.406: CB1.S57 JP2.12 | JP2.12 | CB1.T57 29.84,31.43 CB1.S58 29.84,28 CB1.T58 | JP6.11 | CB2.S57 JP6.11 | CB2.T57 CB2.S58 CB2.T58 | CB2.T57 | CB2.T58
  Bottom 0.203: CB1.T57 29.84,33.91 28.57,35.18 28.57,52.07 JP6.11
N$1  (via drill 0.4)
  Top 0.203: R4.2 15.62,45.65 v15.17,46.1
  Bottom 0.203: v15.17,46.1 15.17,47.38 SJ1.1
N$2  (via drill 0.4)
  Top 0.406: U1.3 12.32,49.05 11.78,48.51 11.37,48.51 v11.45,48.43
  Bottom 0.406: v11.45,48.43 11.45,49.89 SJ2.1
N$4  (via drill 0.4)
  Top 0.203: R1.1 15.49,51.44 15.14,51.79 11.38,51.79 10.71,52.47 10.27,52.47 10,52.2 9.05,52.2 8.88,52.37 8.4,52.37 v8.25,52.52 | v3.18,54.23 2.41,53.47 LED1.C
  Bottom 0.203: v3.18,54.23 3.3,54.1 3.3,52.87 3.97,52.2 7.94,52.2 v8.25,52.52
N$5
  Top 0.203: U1.1 14.51,49.28 R1.2 R2.2
N$7  (via drill 0.4)
  Top 0.203: R2.1 15.68,46.99 17.78,46.99 18.41,46.36 18.41,45.09 17.65,44.32 8.51,44.32 8.51,44.33 8.13,44.71 v8.13,44.9 | LED2.A 2.41,43.05 v3.18,42.29
  Bottom 0.203: v3.18,42.29 3.18,44.7 3.81,45.34 7.69,45.34 v8.13,44.9
N$8
  Top 0.203: U1.5 14.29,45.28 R4.1 R3.1
N$49  (via drill 1.14 pad 1.91)
  other vias: 9.52,16.51
N$50  (via drill 1.14 pad 1.91)
  other vias: 9.52,19.05
N$51  (via drill 1.14 pad 1.91)
  other vias: 9.52,21.59
PR1  (via drill 1.14 pad 1.91)
  Bottom 0.508: v14.61,16.51 v14.61,19.05 v14.61,21.59
PR2  (via drill 1.14 pad 1.91)
  Bottom 0.508: v17.14,21.59 v17.14,19.05 v17.14,16.51
PR3  (via drill 1.14 pad 1.91)
  Bottom 0.508: v19.69,16.51 v19.69,19.05 v19.69,21.59
PR4  (via drill 1.14 pad 1.91)
  Bottom 0.508: v22.23,21.59 v22.23,19.05 v22.23,16.51
PR5  (via drill 1.14 pad 1.91)
  Bottom 0.508: v24.77,16.51 v24.77,19.05 v24.77,21.59
PR6  (via drill 1.14 pad 1.91)
  Bottom 0.508: v27.3,21.59 v27.3,19.05 v27.3,16.51
PR7  (via drill 1.14 pad 1.91)
  Bottom 0.508: v29.84,16.51 v29.84,19.05 v29.84,21.59
PR8  (via drill 1.14 pad 1.91)
  Bottom 0.508: v32.38,21.59 v32.38,19.05 v32.38,16.51
PR9  (via drill 1.14 pad 1.91)
  Bottom 0.508: v34.92,16.51 v34.92,19.05 v34.92,21.59
PR10  (via drill 1.14 pad 1.91)
  Bottom 0.508: v37.47,21.59 v37.47,19.05 v37.47,16.51
PR11  (via drill 1.14 pad 1.91)
  Bottom 0.508: v40.01,16.51 v40.01,19.05 v40.01,21.59
PR12  (via drill 1.14 pad 1.91)
  Bottom 0.508: v42.55,21.59 v42.55,19.05 v42.55,16.51
PR13  (via drill 1.14 pad 1.91)
  Bottom 0.508: v17.14,50.8 v17.14,48.26 v17.14,45.72
PR14  (via drill 1.14 pad 1.91)
  Bottom 0.508: v19.69,45.72 v19.69,48.26 v19.69,50.8
PR15  (via drill 1.14 pad 1.91)
  Bottom 0.508: v22.23,50.8 v22.23,48.26 v22.23,45.72
PR16  (via drill 1.14 pad 1.91)
  Bottom 0.508: v24.77,45.72 v24.77,48.26 v24.77,50.8
PR17  (via drill 1.14 pad 1.91)
  Bottom 0.508: v27.3,50.8 v27.3,48.26 v27.3,45.72
PR18  (via drill 1.14 pad 1.91)
  Bottom 0.508: v29.84,45.72 v29.84,48.26 v29.84,50.8
PR19  (via drill 1.14 pad 1.91)
  Bottom 0.508: v32.38,50.8 v32.38,48.26 v32.38,45.72
PR20  (via drill 1.14 pad 1.91)
  Bottom 0.508: v34.92,45.72 v34.92,48.26 v34.92,50.8
PR21  (via drill 1.14 pad 1.91)
  Bottom 0.508: v37.47,50.8 v37.47,48.26 v37.47,45.72
PR22  (via drill 1.14 pad 1.91)
  Bottom 0.508: v40.01,45.72 v40.01,48.26 v40.01,50.8
PR23  (via drill 1.14 pad 1.91)
  Bottom 0.508: v42.55,50.8 v42.55,48.26 v42.55,45.72
VBAT  (via drill 0.4)
  Top 0.406: 10.45,49.31 10.6,49.15 Q3.3 | 10.45,49.31 10.35,49.4 10.21,49.26 X3.2 6.67,49.85 v6.67,50.42 | C2.1 12.26,50.61 10.95,49.31 10.45,49.31
  Bottom 0.406: v6.67,50.42 6.67,50.1 6.86,49.91 SJ2.2
VBUS  (via drill 0.4)
  Top 0.406: CB1.S79 1.91,25.53 | 1.91,25.53 | 1.91,25.53 JP2.1 | CB1.S79 1.91,28 CB1.T80 | CB1.S79 1.52,26.99 1.52,30.16 CB1.T79 1.91,30.54 CB1.S80 0.64,33.15 0.64,38.33 v0.66,38.35 | CB2.S80 CB2.T79 | CB2.T79 | CB2.T79 1.91,59.21 1.72,59.02 1.72,57.82 1.91,57.63 CB2.T80 CB2.S79 | CB2.S79 | LED1.A 0.77,54.62 CB2.S79 | v4.19,49.09 4.19,48.64 4.67,48.17 9.74,48.17 10.6,47.3 C1.1 11.02,47.18 11.75,46.45 U1.4 12.76,46.83 v12.76,47.69 | Q3.1 11.1,51 10.67,51.44 | 10.67,51.44 v10.74,51.44 | R5.2 10.54,51.56 10.67,51.44
  Bottom 0.406: v4.19,49.09 1.65,49.09 | CB2.T80 1.91,49.34 1.65,49.09 | v0.66,38.35 0.66,48.09 1.65,49.09 | v10.74,51.44 12.06,51.44 12.76,50.74 v12.76,47.69
VREF
  Top 0.406: JP2.6 CB1.S69 14.61,28 | JP2.6 | CB1.T69 14.61,30.54 CB1.S70 14.61,28 | 14.61,28 CB1.T70 | CB2.T69 CB2.S70 CB2.T70 | CB2.T69 | CB2.S69 | CB2.S69 CB2.T70 | CB2.S69 JP6.5 | JP6.5 | CB2.T70
  Bottom 0.203: CB1.T69 14.61,34.67 13.34,35.94 13.34,47.26 13.47,47.39 13.47,52.21 JP6.5
VSYS
  Top 0.406: CB1.S77 JP2.2 | JP2.2 | CB1.S77 4.45,27.11 CB1.T78 | CB1.S77 4.83,26.99 4.83,30.54 4.45,30.54 | 4.45,30.54 CB1.T77 | 4.45,30.54 CB1.S78 4.45,32.51 5.71,33.78 5.71,44.51 3.3,46.93 3.3,49.53 4.19,50.42 4.19,52.83 4.45,52.58 JP6.1 | JP6.1 CB2.S77 | CB2.S78 CB2.T77 | CB2.T77 | CB2.T77 4.45,59.21 4.63,59.02 4.63,57.82 4.45,57.63 CB2.T78 CB2.S77 | CB2.S77 | JP6.1 4.45,53.85 7.75,50.54 Q3.2

### Text on the board
Pinguin_tBackup: GND | EN | 3.3V | VREF | AD2 | GND | AD1 | AD0 | RST | IO22 | GND | IO21 | IO20 | IO19 | IO18 | GND | VB | VS | 3V | Vr | A2 | A0 | R | 22 | 20 | 19 | 18 | 17 | 16 | I2C | G | On | 3 | Enable | RESET | D | Off | C | QT | 0 | 1 | 2 | 3 | 4 | 5 | 6 | 7 | 8 | 9 | 11 | 12 | 13 | 14 | 15 | VB | VS | 3V | Vr | A0 | R | 22 | 20 | 19 | 18 | 17 | 16 | A2 | I2C | G | 3 | RESET | D | C | QT | 0 | 1 | 2 | 3 | 4 | 5 | 6 | 7 | 8 | 9 | 11 | 12 | 13 | 14 | 15 | GND | IO2 | IO3 | IO4 | IO5 | GND | IO6 | IO7 | IO8 | IO9 | GND | IO10 | IO11 | IO12 | IO13 | GND
Pinguin_bBackup: Under | Proto | Plate | VB | VS | 3V | Vr | A2 | A0 | R | 22 | 20 | 19 | 18 | 17 | 16 | GN | USB | GND | Cut to / disable / LiPo chg | 3V | 3.3V | Prototyping / PiCowbell | DA | SDA | Cut for 250mA | SCL | CL | 0 | 1 | 2 | 3 | 4 | 5 | 6 | 7 | 8 | 9 | 11 | 12 | 13 | 14 | 15 | VB | VS | 3V | Vr | A2 | A0 | R | 22 | 20 | 19 | 18 | 17 | 16 | GN | USB | GND | 3V | 3.3V | Prototyping / PiCowbell | DA | SDA | SCL | CL | 0 | 1 | 2 | 3 | 4 | 5 | 6 | 7 | 8 | 9 | 11 | 12 | 13 | 14 | 15 | Bell | PiCow